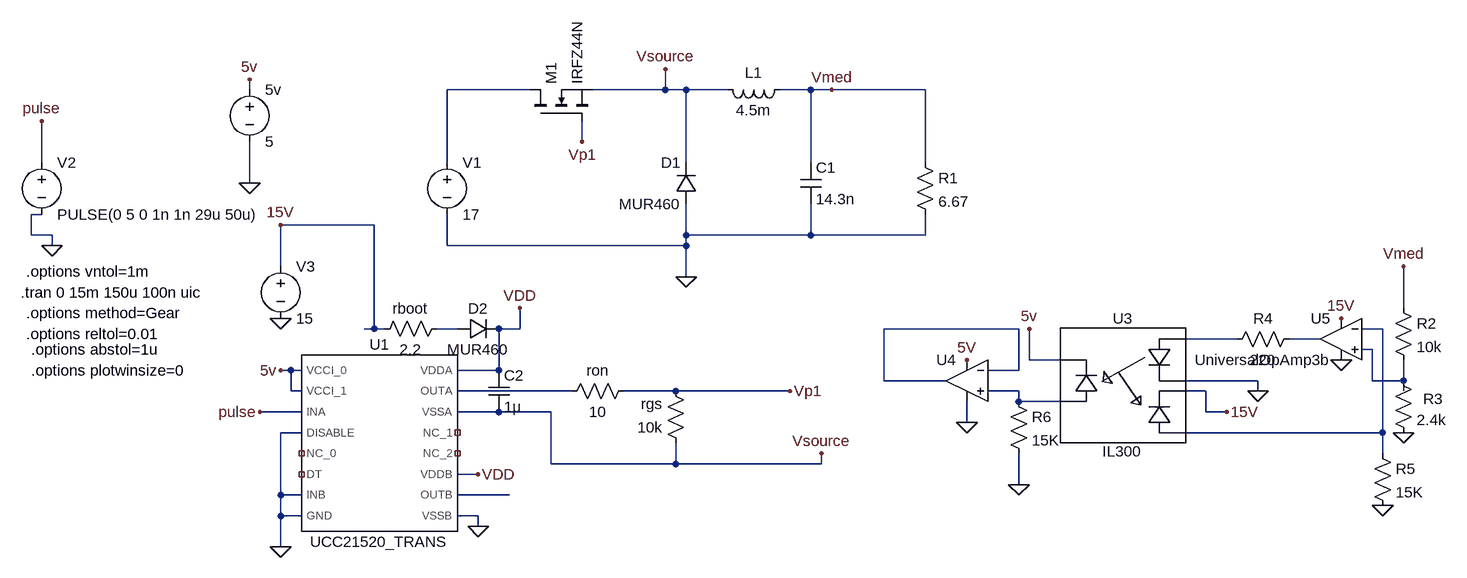
[diagram p0: schematic Draft2.asc]
Draft2.asc, the LTspice schematic file:
Version 4.1
SHEET 1 1700 692
WIRE -160 -32 -160 -48
WIRE 272 -32 144 -32
WIRE 480 -32 480 -64
WIRE 480 -32 368 -32
WIRE 512 -32 480 -32
WIRE 576 -32 512 -32
WIRE 704 -32 656 -32
WIRE 736 -32 704 -32
WIRE 880 -32 736 -32
WIRE 352 48 352 16
WIRE -480 80 -480 16
WIRE 144 80 144 -32
WIRE 512 80 512 -32
WIRE 704 80 704 -32
WIRE 880 80 880 -32
WIRE -160 112 -160 48
WIRE -480 160 -496 160
WIRE 32 176 -112 176
WIRE -496 192 -496 160
WIRE -464 192 -496 192
WIRE 512 192 512 144
WIRE 704 192 704 144
WIRE 704 192 512 192
WIRE 880 192 880 160
WIRE 880 192 704 192
WIRE -464 208 -464 192
WIRE 144 208 144 160
WIRE 512 208 512 192
WIRE 512 208 144 208
WIRE -112 240 -112 176
WIRE 512 256 512 208
WIRE 1616 304 1616 240
WIRE 32 336 32 176
WIRE 32 336 16 336
WIRE 48 336 32 336
WIRE 160 336 128 336
WIRE 256 336 256 304
WIRE 256 336 224 336
WIRE 1024 336 816 336
WIRE 1584 336 1552 336
WIRE 1360 352 1280 352
WIRE 1488 352 1440 352
WIRE 1568 368 1552 368
WIRE 1040 384 1040 336
WIRE 1088 384 1040 384
WIRE -96 400 -112 400
WIRE -80 400 -96 400
WIRE 224 400 224 336
WIRE 224 400 160 400
WIRE 1024 400 1024 336
WIRE 1024 400 976 400
WIRE 816 416 816 336
WIRE 912 416 816 416
WIRE 1392 416 1280 416
WIRE 1568 416 1568 368
WIRE 1616 416 1616 384
WIRE 1616 416 1568 416
WIRE -96 432 -96 400
WIRE -80 432 -96 432
WIRE 336 432 160 432
WIRE 496 432 416 432
WIRE 672 432 496 432
WIRE 1024 432 976 432
WIRE 1312 432 1280 432
WIRE 1392 432 1392 416
WIRE 1616 432 1616 416
WIRE 1024 448 1024 432
WIRE 1088 448 1024 448
WIRE -80 464 -144 464
WIRE 224 464 160 464
WIRE 304 464 224 464
WIRE 1312 464 1312 432
WIRE 1344 464 1312 464
WIRE 944 480 944 448
WIRE -80 496 -112 496
WIRE 1584 496 1584 336
WIRE 1584 496 1280 496
WIRE 1584 528 1584 496
WIRE 304 544 304 464
WIRE 496 544 496 512
WIRE 496 544 304 544
WIRE 720 544 720 528
WIRE 720 544 496 544
WIRE 192 560 160 560
WIRE 1024 576 1024 528
WIRE -112 592 -112 496
WIRE -80 592 -112 592
WIRE 240 592 160 592
WIRE -112 624 -112 592
WIRE -80 624 -112 624
WIRE 192 624 160 624
WIRE 192 640 192 624
WIRE -112 672 -112 624
FLAG 512 256 0
FLAG -464 208 0
FLAG -480 16 pulse
FLAG -144 464 pulse
FLAG -112 400 5v
FLAG -160 -48 5v
FLAG 352 48 Vp1
FLAG -112 320 0
FLAG 192 640 0
FLAG 256 304 VDD
FLAG 192 560 VDD
FLAG 672 432 Vp1
FLAG 720 528 Vsource
FLAG 480 -64 Vsource
FLAG 736 -32 Vmed
FLAG 1616 240 Vmed
FLAG -112 176 15V
FLAG 1344 464 15V
FLAG 1616 496 0
FLAG 1584 608 0
FLAG 1520 320 15V
FLAG 944 384 5V
FLAG 944 480 0
FLAG 1520 384 0
FLAG 1024 576 0
FLAG 1392 432 0
FLAG -160 112 0
FLAG -112 672 0
FLAG 1040 336 5v
SYMBOL voltage 144 64 R0
WINDOW 123 0 0 Left 0
WINDOW 39 0 0 Left 0
SYMATTR InstName V1
SYMATTR Value 17
SYMBOL voltage -480 64 R0
WINDOW 123 0 0 Left 0
WINDOW 39 0 0 Left 0
SYMATTR InstName V2
SYMATTR Value PULSE(0 5 0 1n 1n 29u 50u)
SYMBOL diode 528 144 R180
WINDOW 0 24 64 Left 2
WINDOW 3 24 0 Left 2
SYMATTR InstName D1
SYMATTR Value MUR460
SYMBOL cap 688 80 R0
SYMATTR InstName C1
SYMATTR Value 14.3n
SYMBOL ind 672 -48 R90
WINDOW 0 5 56 VBottom 2
WINDOW 3 32 56 VTop 2
SYMATTR InstName L1
SYMATTR Value 4.5m
SYMATTR SpiceLine Rser=1m
SYMBOL res 864 64 R0
SYMATTR InstName R1
SYMATTR Value 6.67
SYMBOL UCC21520_TRANS 32 512 R0
SYMATTR InstName U1
SYMBOL res 144 320 R90
WINDOW 0 0 56 VBottom 2
WINDOW 3 32 56 VTop 2
SYMATTR InstName rboot
SYMATTR Value 2.2
SYMBOL res 432 416 R90
WINDOW 0 0 56 VBottom 2
WINDOW 3 32 56 VTop 2
SYMATTR InstName ron
SYMATTR Value 10
SYMBOL res 512 528 R180
WINDOW 0 36 76 Left 2
WINDOW 3 36 40 Left 2
SYMATTR InstName rgs
SYMATTR Value 10k
SYMBOL voltage -160 -48 R0
WINDOW 123 0 0 Left 0
WINDOW 39 0 0 Left 0
SYMATTR InstName 5v
SYMATTR Value 5
SYMBOL nmos 272 16 R270
SYMATTR InstName M1
SYMATTR Value IRFZ44N
SYMBOL diode 160 352 R270
WINDOW 0 32 32 VTop 2
WINDOW 3 0 32 VBottom 2
SYMATTR InstName D2
SYMATTR Value MUR460
SYMBOL voltage -112 224 R0
WINDOW 123 0 0 Left 0
WINDOW 39 0 0 Left 0
SYMATTR InstName V3
SYMATTR Value 15
SYMBOL cap 208 400 R0
SYMATTR InstName C2
SYMATTR Value 1µ
SYMBOL res 1600 288 R0
SYMATTR InstName R2
SYMATTR Value 10k
SYMBOL res 1600 400 R0
WINDOW 0 46 44 Left 2
SYMATTR InstName R3
SYMATTR Value 2.4k
SYMBOL res 1456 336 R90
WINDOW 0 0 56 VBottom 2
WINDOW 3 32 56 VTop 2
SYMATTR InstName R4
SYMATTR Value 220
SYMBOL res 1568 512 R0
SYMATTR InstName R5
SYMATTR Value 15K
SYMBOL lib\\sym\\OpAmps\\UniversalOpAmp 944 416 M0
SYMATTR InstName U4
SYMBOL res 1008 432 R0
SYMATTR InstName R6
SYMATTR Value 15K
SYMBOL OpAmps\\UniversalOpAmp3b 1520 352 M0
SYMATTR InstName U5
SYMBOL IL300 1184 416 M0
SYMATTR InstName U3
TEXT -512 280 Left 2 !.tran 0 15m 150u 100n uic
TEXT -504 248 Left 2 !.options vntol=1m
TEXT -504 312 Left 2 !.options method=Gear
TEXT -504 344 Left 2 !.options reltol=0.01
TEXT -496 368 Left 2 !.options abstol=1u
TEXT -496 400 Left 2 !.options plotwinsize=0

The netlist it stands for:
* Draft2.asc
V1 N001 0 17
V2 pulse 0 PULSE(0 5 0 1n 1n 29u 50u)
D1 0 Vsource MUR460
C1 Vmed 0 14.3n
L1 Vmed Vsource 4.5m Rser=1m
R1 Vmed 0 6.67
X§U1 0 NC_01 0 pulse 0 N008 N010 5v 5v VDD VDD Vsource 0 NC_02 NC_03 NC_04 UCC21520_TRANS  ; pins DISABLE DT GND INA INB OUTA OUTB VCCI_0 VCCI_1 VDDA VDDB VSSA VSSB NC_0 NC_1 NC_2
rboot N002 15V 2.2
ron Vp1 N008 10
rgs Vsource Vp1 10k
V§5v 5v 0 5
M1 N001 Vp1 Vsource Vsource IRFZ44N
D2 N002 VDD MUR460
V3 15V 0 15
C2 VDD Vsource 1µ
R2 Vmed N007 10k
R3 N007 0 2.4k
R4 N006 N005 220
R5 N004 0 15K
X§U4 N009 N003 5v 0 N003 level1 Avol=1Meg GBW=10Meg Vos=0 En=0 Enk=0 In=0 Ink=0 Rin=500Meg  ; pins In+ In- V+ V- OUT
R6 N009 0 15K
* U5: UniversalOpAmp3b (symbol OpAmps\UniversalOpAmp3b not available, pins judged from their places): In+=N007 In-=N004 V+=15V V-=0 OUT=N006
X§U3 0 N005 15V N004 N009 5v IL300  ; pins LEDC LEDA PD1C PD1A PD2A PD2C
.model D D
.lib standard.dio
.model NMOS NMOS
.model PMOS PMOS
.lib standard.mos
.tran 0 15m 150u 100n uic
.options vntol=1m
.options method=Gear
.options reltol=0.01
.options abstol=1u
.options plotwinsize=0
.lib UCC21520_TRANS.lib
.lib UniversalOpAmp1.lib
.lib IL300.SUB
.backanno
.end